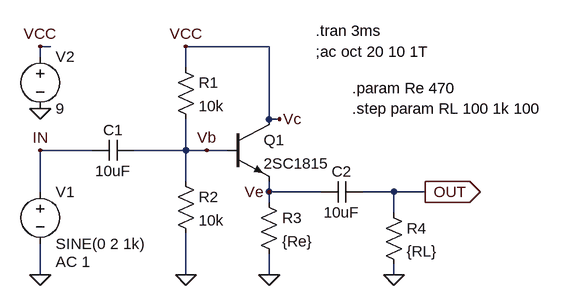
[diagram p0: schematic Emitter_Follwer.asc]
Emitter_Follwer.asc, the LTspice schematic file:
Version 4
SHEET 1 880 680
WIRE 16 16 0 16
WIRE 352 16 224 16
WIRE 0 32 0 16
WIRE 224 48 224 16
WIRE 352 128 352 16
WIRE 368 128 352 128
WIRE 80 176 0 176
WIRE 224 176 224 128
WIRE 224 176 144 176
WIRE 256 176 224 176
WIRE 288 176 256 176
WIRE 224 224 224 176
WIRE 0 240 0 176
WIRE 352 240 352 224
WIRE 432 240 352 240
WIRE 544 240 496 240
WIRE 592 240 544 240
WIRE 352 256 352 240
WIRE 544 272 544 240
WIRE 0 368 0 320
WIRE 224 368 224 304
WIRE 352 368 352 336
WIRE 544 368 544 352
FLAG 0 368 0
FLAG 0 112 0
FLAG 0 16 VCC
FLAG 224 368 0
FLAG 352 368 0
FLAG 592 240 OUT
IOPIN 592 240 Out
FLAG 224 16 VCC
FLAG 544 368 0
FLAG 0 176 IN
FLAG 256 176 Vb
FLAG 352 240 Ve
FLAG 368 128 Vc
SYMBOL npn 288 128 R0
SYMATTR InstName Q1
SYMATTR Value 2SC1815
SYMBOL voltage 0 224 R0
WINDOW 123 24 124 Left 2
WINDOW 39 0 0 Left 2
SYMATTR Value2 AC 1
SYMATTR InstName V1
SYMATTR Value SINE(0 2 1k)
SYMBOL cap 144 160 R90
WINDOW 0 0 32 VBottom 2
WINDOW 3 32 32 VTop 2
SYMATTR InstName C1
SYMATTR Value 10uF
SYMBOL voltage 0 16 R0
WINDOW 123 0 0 Left 2
WINDOW 39 0 0 Left 2
SYMATTR InstName V2
SYMATTR Value 9
SYMBOL res 208 32 R0
SYMATTR InstName R1
SYMATTR Value 10k
SYMBOL res 208 208 R0
SYMATTR InstName R2
SYMATTR Value 10k
SYMBOL res 336 240 R0
SYMATTR InstName R3
SYMATTR Value {Re}
SYMBOL cap 496 224 R90
WINDOW 0 0 32 VBottom 2
WINDOW 3 32 32 VTop 2
SYMATTR InstName C2
SYMATTR Value 10uF
SYMBOL res 528 256 R0
SYMATTR InstName R4
SYMATTR Value {RL}
TEXT 424 -8 Left 2 !.tran 3ms
TEXT 480 112 Left 2 !.step param RL 100 1k 100
TEXT 424 24 Left 2 !;ac oct 20 10 1T
TEXT 480 80 Left 2 !.param Re 470

The netlist it stands for:
* Emitter_Follwer.asc
Q1 Vc Vb Ve 0 2SC1815
V1 IN 0 SINE(0 2 1k) AC 1
C1 Vb IN 10uF
V2 Vc 0 9
R1 Vc Vb 10k
R2 Vb 0 10k
R3 Ve 0 {Re}
C2 OUT Ve 10uF
R4 OUT 0 {RL}
.model NPN NPN
.model PNP PNP
.lib standard.bjt
.tran 3ms
.step param RL 100 1k 100
;ac oct 20 10 1T
.param Re 470
.backanno
.end